# EAGLE design LB_BIT_1OUT-LARGE-v03(1_1x) (EAGLE 6.5.0)
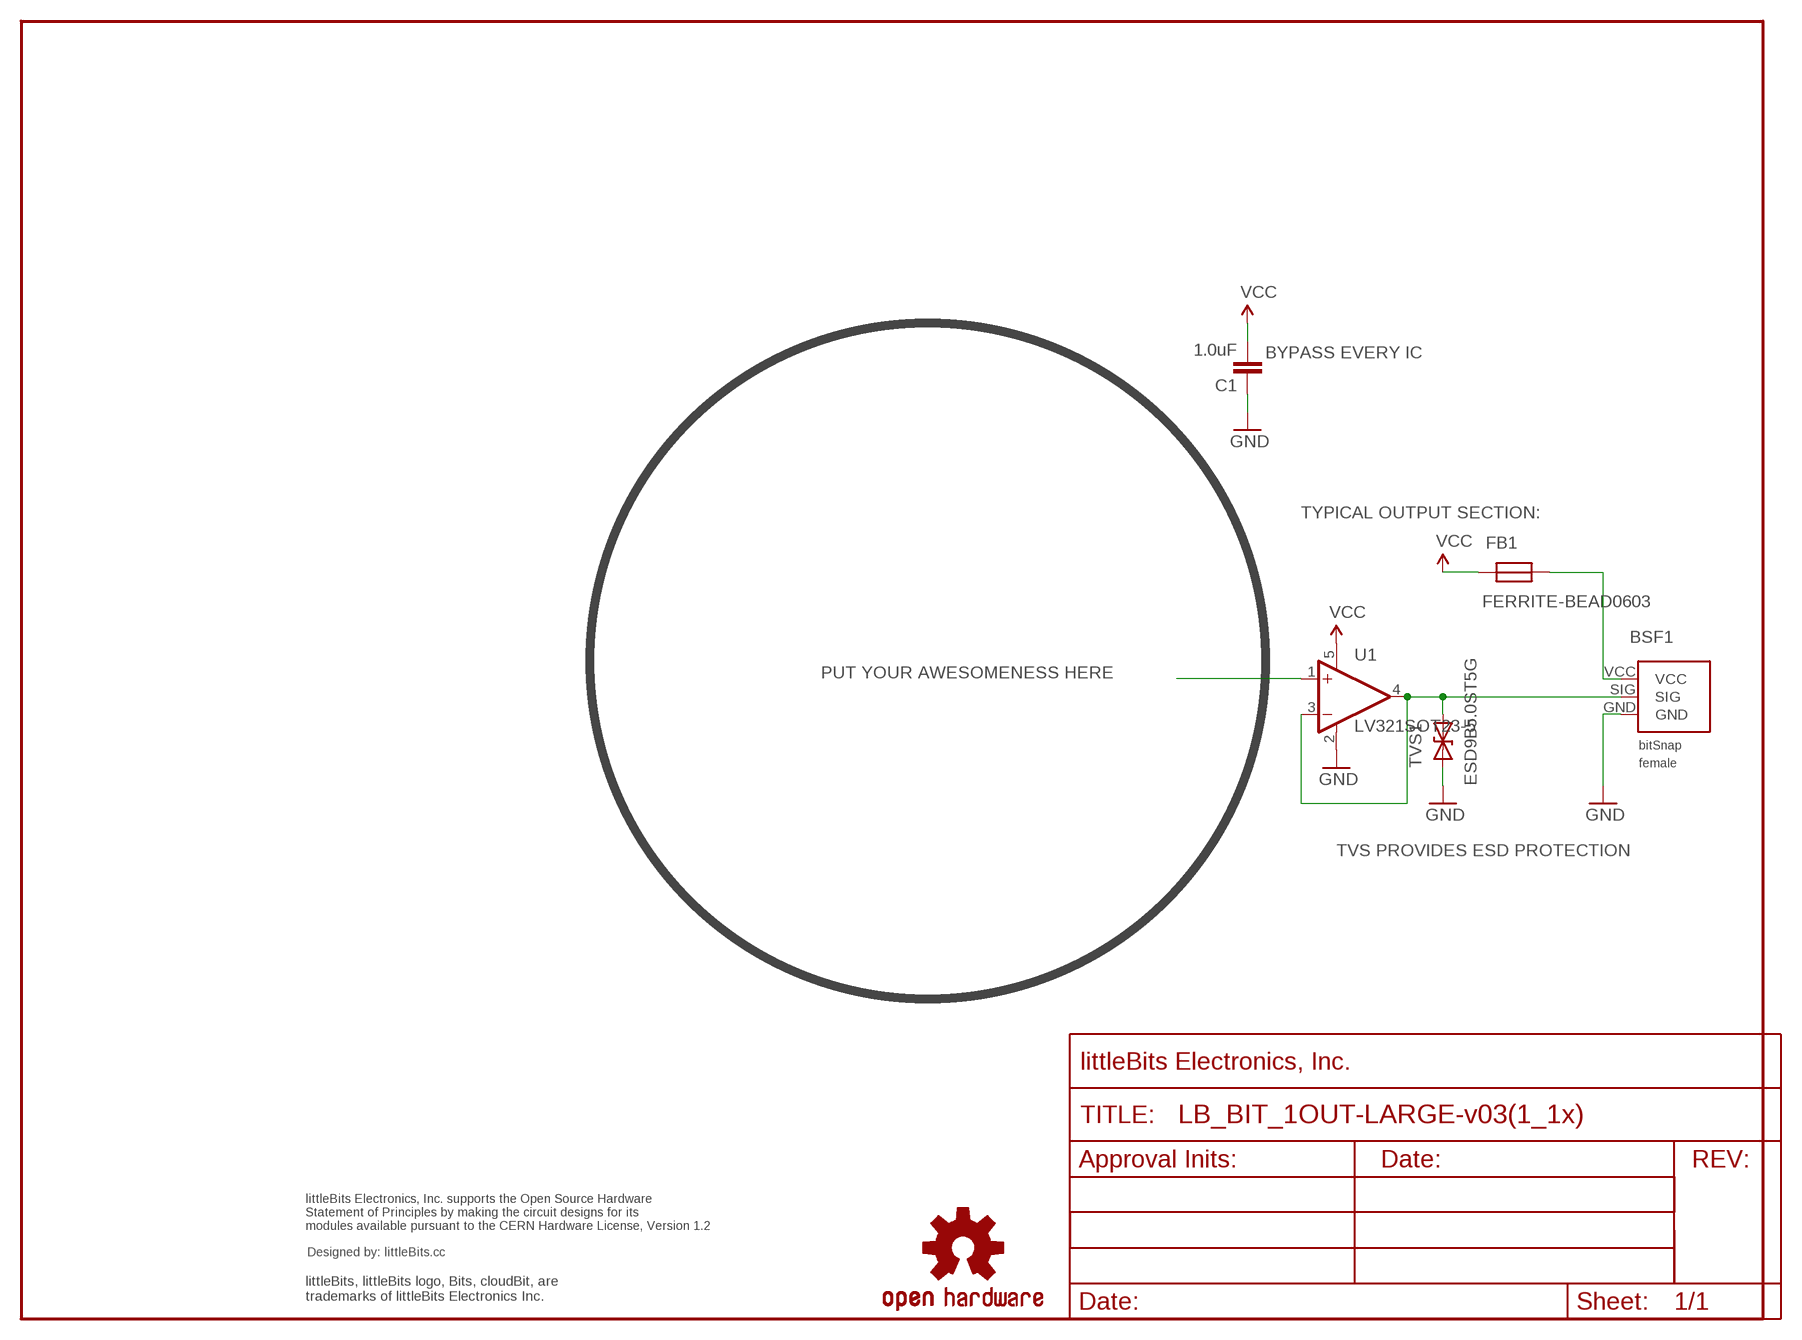
[diagram p0: schematic, sheet 1]

## Parts
BSF1  BITSNAP_V03_FEMALE  [BITSNAP_V03_FEMALE]
C1  1.0uF  CAPCAP-0603  [CAP-0603]
FB1  FERRITE-BEAD0603  [R0603]
FRAME1  FRAME-LETTERWHITEMASK  [FABDWG01-WHITEMASK]
TVS1  ESD9B5.0ST5G  DIODE-TVSSOD-923  [SOD-923]
U1  LV321SOT23-5  [SOT23-5]
U$3  OSHW-LOGOL  [OSHW-LOGO-L]
U$4  OSHWCREDIT  [OSHWCREDIT]

## Nets
GND: BSF1.GND C1.1 TVS1.1(A) U1.2(V-)
N$2: BSF1.VCC FB1.1
N$12: U1.1(+IN)
SIG_OUT: BSF1.SIG TVS1.2(C) U1.3(-IN) U1.4(OUT)
VCC: C1.2 FB1.2 U1.5(V+)

## Notes on the sheet
- BYPASS EVERY IC
- TYPICAL OUTPUT SECTION:
- PUT YOUR AWESOMENESS HERE
- TVS PROVIDES ESD PROTECTION

## Library data of the parts
BSF1 = bitSnap:BITSNAP_V03_FEMALE
C1 = LITTLEBITS:CAP
FB1 = LITTLEBITS:FERRITE-BEAD
FRAME1 = LITTLEBITS:FRAME-LETTER: Schematic Frame Standard 8.5x11 US Letter frame
TVS1 = LITTLEBITS:DIODE-TVS: Bidirectional Transient Voltage Suppression Diode: Device conducts in avalanche mode after reaching a part dependent voltage threshold. Used for limiting voltage spikes on ESD sensitive inputs and outputs.; IEC_ESD_PROT0: +/-18kV; LB_PN: ?; MPN: ESD9B5.0ST5G; V_CLAMP: ?; V_OPERATION: 5V
U1 = LITTLEBITS:LV321
U$3 = SparkFun:OSHW-LOGO: Open Source Hardware Logo This logo indicates the piece of hardware it is found on incorporates a OSHW license and/or adheres to the definition of open source hardware found here: http://freedomdefined.org/OSHW
U$4 = LITTLEBITS:OSHWCREDIT

## Board
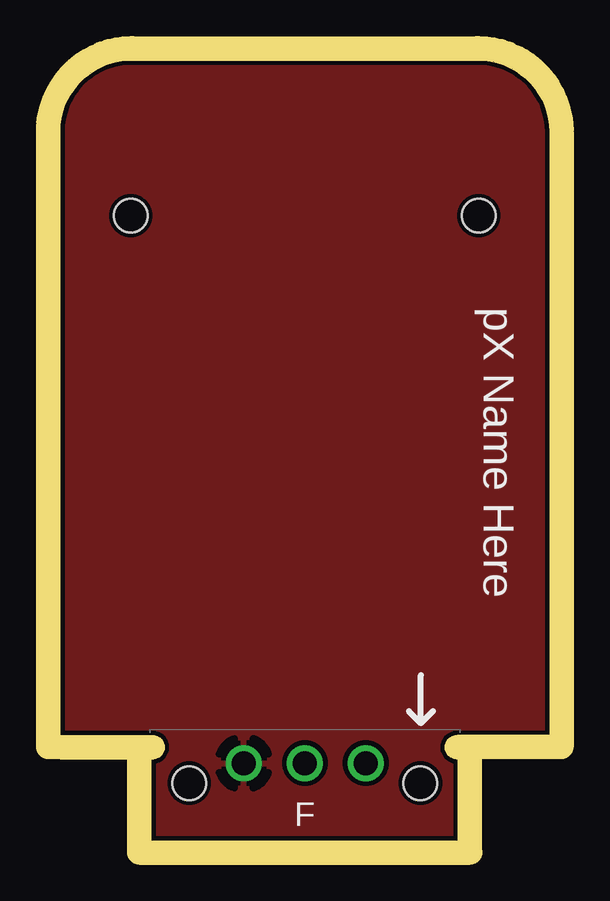
[diagram p1: board, top side]
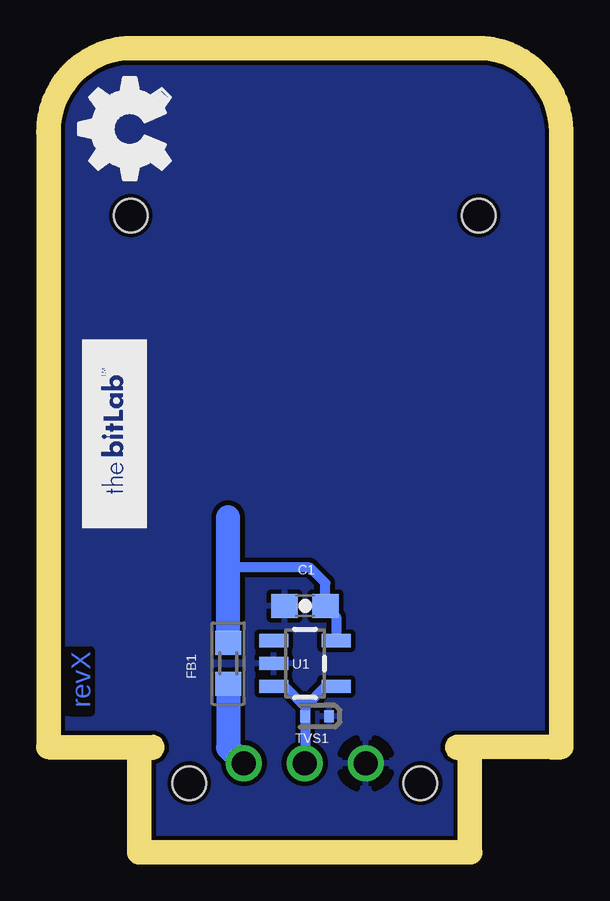
[diagram p2: board, bottom side, seen from below]

Size 20.4 x 32.55 mm. Coordinates in mm from the lower left corner, seen from the top.
Outline: 0,4.4 0,29.55
Outline: 0,29.55 0,29.61
Outline: 20.4,4.4 20.4,29.55 arc90 17.4,32.55 3,32.55 arc90 0,29.55
Copper layers (1*16): Top 0.035mm / dielectric 1.5mm / Bottom 0.035mm
Design rules "littleBitsDRC": minimum track width 0.2mm, minimum drill 0.2mm, track to track 0.2mm, track to pad 0.2mm, pad to pad 0.2mm, via to via 0.2mm, smd to smd 0mil, copper to edge 0.2mm, drill to drill 0.2mm, minimum pad ring 0.1mm, minimum via ring 0.15mm, stop-mask expansion 0.1mm, vias tented up to drill 0.5mm, thermal gap 0.2mm
Milling: 7 lines

### Footprints (pad centres in the part's own frame; a part is rotated, then mirrored left to right if it is on the bottom)
BITSNAP_V03_FEMALE = drill 1: GND 4.065,3.44; SIG 6.605,3.44; VCC 9.145,3.44 | hole 1.4: 1.785,2.61; 11.425,2.61
CAP-0603 = smd 1.1 x 1: 1 -0.85,0; 2 0.85,0
R0603 = smd 1 x 1.1: 1 -0.85,0; 2 0.85,0
SOD-923 = smd 0.4 x 0.5: 1 -0.5,0; 2 0.5,0
SOT23-5 = smd 0.55 x 1.2: 1 -0.95,-1.3; 2 0,-1.3; 3 0.95,-1.3; 4 0.95,1.3; 5 -0.95,1.3
LB_PWR_LEGS = hole 1.4: -0.645,-0.15; 13.855,-0.15

### Placement (x,y rotation side)
BSF1  3.6,-0.21 0 top
C1  10.19,9.79 0 bottom
FB1  13.39,7.39 90 bottom
FRAME1  -3.01,-0.21 0 top  (outside the outline)
TVS1  9.69,5.19 180 bottom
U1  10.19,7.39 270 bottom
U$1  [BITLAB-LOGO]  16.79,20.89 270 top
U$2  [OSHW_FILLX150_NOTEXT]  15.81,26.72 0 top
U$3  -38.23,-67.11 0 top  (outside the outline)
U$4  -97.47,-63.04 0 top  (outside the outline)
U$12  [LB_PWR_LEGS]  3.6,26.21 0 top

### Tracks (layer width: path | path; a pad name or v marks a point on that pad's centre or on a via)
GND
  pour Top: 0.15,32.38 20.23,32.38 20.23,0.01 0.15,0.01
  pour Bottom: 0.15,32.38 20.23,32.38 20.23,0.01 0.15,0.01
N$2
  Bottom 1: FB1.1 13.39,3.88 BSF1.VCC
SIG_OUT
  Bottom 0.406: U1.3 11.04,6.44 10.19,5.59 | U1.4 9.34,6.44 10.19,5.59 | 10.19,5.59 TVS1.2 BSF1.SIG
VCC
  Bottom 0.406: 13.39,11.39 9.99,11.39 9.34,10.74 C1.2 8.89,9.34 U1.5
  Bottom 1: FB1.2 13.39,11.39 13.39,13.49

### Text on the board
Bottom: revX
tPlace: pX Name Here
Milling: 1mm DIA. ROUTER PATH